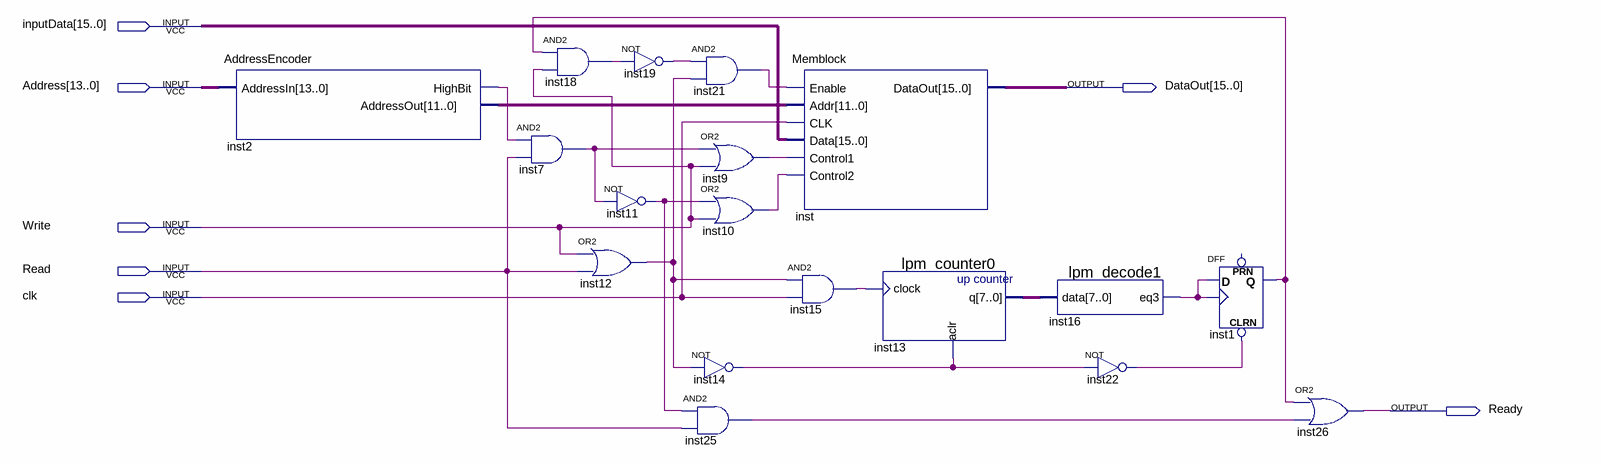
[diagram p0: schematic sheet]
// Quartus schematic MemUnit.bdf as structural Verilog: 18 symbols, 7 pins
module MemUnit (
  input  [15:0] inputData,
  input  [13:0] Address,
  input  Write,
  input  Read,
  input  clk,
  output [15:0] DataOut,
  output Ready
);

  wire inst1_q, inst2_highbit, inst7_out, inst9_out, inst10_out, inst11_out, inst12_out, inst14_out,
       inst15_out, inst16_eq3, inst18_out, inst19_out, inst21_out, inst22_out, inst25_out;
  wire [7:0] inst13_q;
  wire [11:0] inst2_addressout;

  AddressEncoder inst2 (.AddressIn(Address), .HighBit(inst2_highbit), .AddressOut(inst2_addressout));
  and inst7 (inst7_out, inst2_highbit, Read);
  and inst18 (inst18_out, inst1_q, Write);
  or inst12 (inst12_out, Write, Read);
  not inst19 (inst19_out, inst18_out);
  not inst11 (inst11_out, inst7_out);
  and inst21 (inst21_out, inst19_out, inst12_out);
  or inst9 (inst9_out, inst7_out, Write);
  or inst10 (inst10_out, inst11_out, Write);
  not inst14 (inst14_out, inst12_out);
  and inst25 (inst25_out, inst11_out, Read);
  Memblock inst (
    .Enable(inst21_out), .Addr(inst2_addressout), .CLK(clk), .Data(inputData), .Control1(inst9_out),
    .Control2(inst10_out), .DataOut(DataOut));
  and inst15 (inst15_out, inst12_out, clk);
  lpm_counter0 inst13 (.clock(inst15_out), .aclr(inst14_out), .q(inst13_q));
  lpm_decode1 inst16 (.data(inst13_q), .eq3(inst16_eq3));
  not inst22 (inst22_out, inst14_out);
  DFF inst1 (.CLRN(inst22_out), .CLK(inst16_eq3), .D(inst16_eq3), .Q(inst1_q));  // open: PRN
  or inst26 (Ready, inst1_q, inst25_out);
endmodule
